# Altium schematic sheet Control.SchDoc
size A4
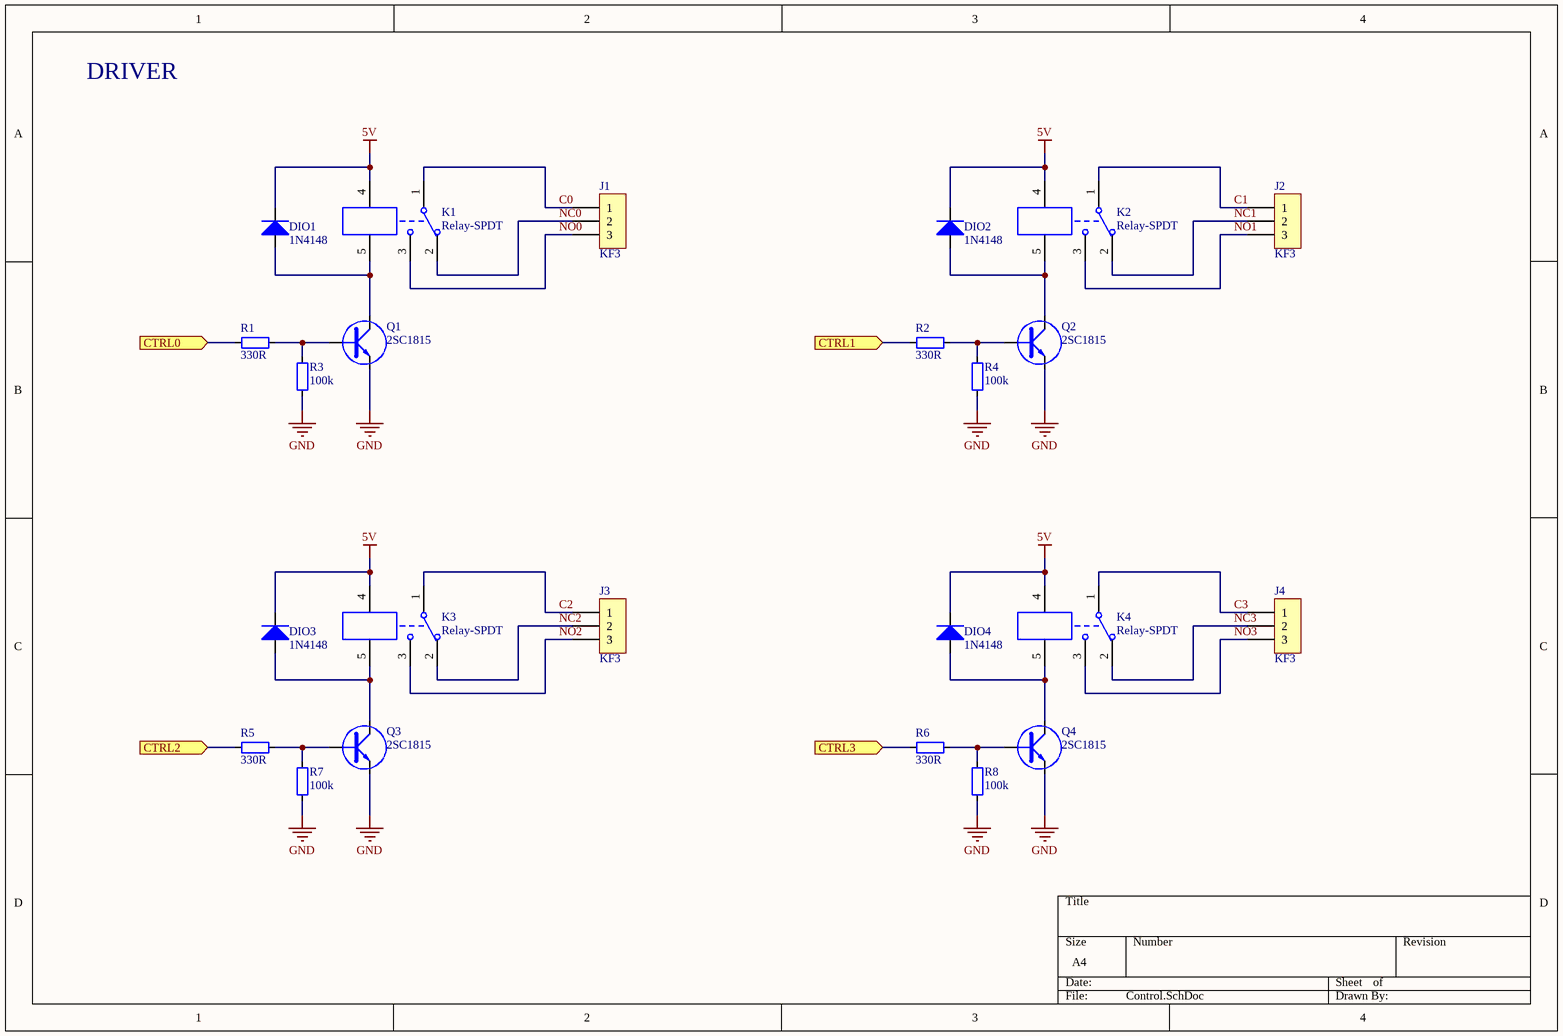
[diagram p0: Control.SchDoc]

## Parts
DIO1  1N4148  [DIO-SMD-106]
DIO2  1N4148  [DIO-SMD-106]
DIO3  1N4148  [DIO-SMD-106]
DIO4  1N4148  [DIO-SMD-106]
J1  KF3  [KF3-5.08]
J2  KF3  [KF3-5.08]
J3  KF3  [KF3-5.08]
J4  KF3  [KF3-5.08]
K1  Relay-SPDT  [RELAY5PIN-10A]
K2  Relay-SPDT  [RELAY5PIN-10A]
K3  Relay-SPDT  [RELAY5PIN-10A]
K4  Relay-SPDT  [RELAY5PIN-10A]
Q1  2SC1815  [SOT23]
Q2  2SC1815  [SOT23]
Q3  2SC1815  [SOT23]
Q4  2SC1815  [SOT23]
R1  330R  [RES-SMD-0805]
R2  330R  [RES-SMD-0805]
R3  100k  [RES-SMD-0805]
R4  100k  [RES-SMD-0805]
R5  330R  [RES-SMD-0805]
R6  330R  [RES-SMD-0805]
R7  100k  [RES-SMD-0805]
R8  100k  [RES-SMD-0805]

## Ports
CTRL0 (in), CTRL1 (in), CTRL2 (in), CTRL3 (in)

## Nets
5V: DIO1.2(K) DIO2.2(K) DIO3.2(K) DIO4.2(K) K1.4 K2.4 K3.4 K4.4
GND: Q1.3(E) Q2.3(E) Q3.3(E) Q4.3(E) R3.1 R4.1 R7.1 R8.1
C0: J1.1 K1.1
C1: J2.1 K2.1
C2: J3.1 K3.1
C3: J4.1 K4.1
CTRL0: R1.1 ; port CTRL0
CTRL1: R2.1 ; port CTRL1
CTRL2: R5.1 ; port CTRL2
CTRL3: R6.1 ; port CTRL3
NC0: J1.2 K1.2
NC1: J2.2 K2.2
NC2: J3.2 K3.2
NC3: J4.2 K4.2
NO0: J1.3 K1.3
NO1: J2.3 K2.3
NO2: J3.3 K3.3
NO3: J4.3 K4.3
NetDIO1_1: DIO1.1(A) K1.5 Q1.2(C)
NetDIO2_1: DIO2.1(A) K2.5 Q2.2(C)
NetDIO3_1: DIO3.1(A) K3.5 Q3.2(C)
NetDIO4_1: DIO4.1(A) K4.5 Q4.2(C)
NetQ1_1: Q1.1(B) R1.2 R3.2
NetQ2_1: Q2.1(B) R2.2 R4.2
NetQ3_1: Q3.1(B) R5.2 R7.2
NetQ4_1: Q4.1(B) R6.2 R8.2

## Notes on the sheet
- DRIVER

## Library data of the parts
DIO1-DIO4 = Diode SMD: Default Diode; Code - JEDEC: DO-214-AB; Value: 1N5007; Published: 8-Jun-2000; Revision: July-2002: Re-released for DXP Platform.; Publisher: Altium Limited
J1-J4 = KF3: Manufacturer: Würth Elektronik eiSos GmbH; partNo: 691103110003; ComponentLink1 Description: Manufacturer; ComponentLink2 Description: Datasheet; NoPins: 3; Created Date: 29 October 2013; ComponentLink1URL: http://www.we-online.com; ComponentLink2URL: http://katalog.we-online.de/em/datasheet/6911031100xx.pdf; Created by: Karrer Zheng
K1-K4 = Relay-SPDT: Single-Pole Dual-Throw Relay; Published: 24-Mar-1999; LatestRevisionDate: 17-Jul-2002; LatestRevisionNote: Re-released for DXP Platform.; PackageReference: MODULE5B; Publisher: Altium Limited
Q1-Q4 = 2SC1815: NPN 600mW, ECB; Value: C1815
R1-R8 = Resistor - SMD: Resistor; Manufacturer: Generic Components; Class: Passive; Published: 08/06/2000; Publisher: Altium Hobart Technology Centre